# EasyEDA Pro project uven2-mk3-cc-driver-80x.eprj, board PCB1
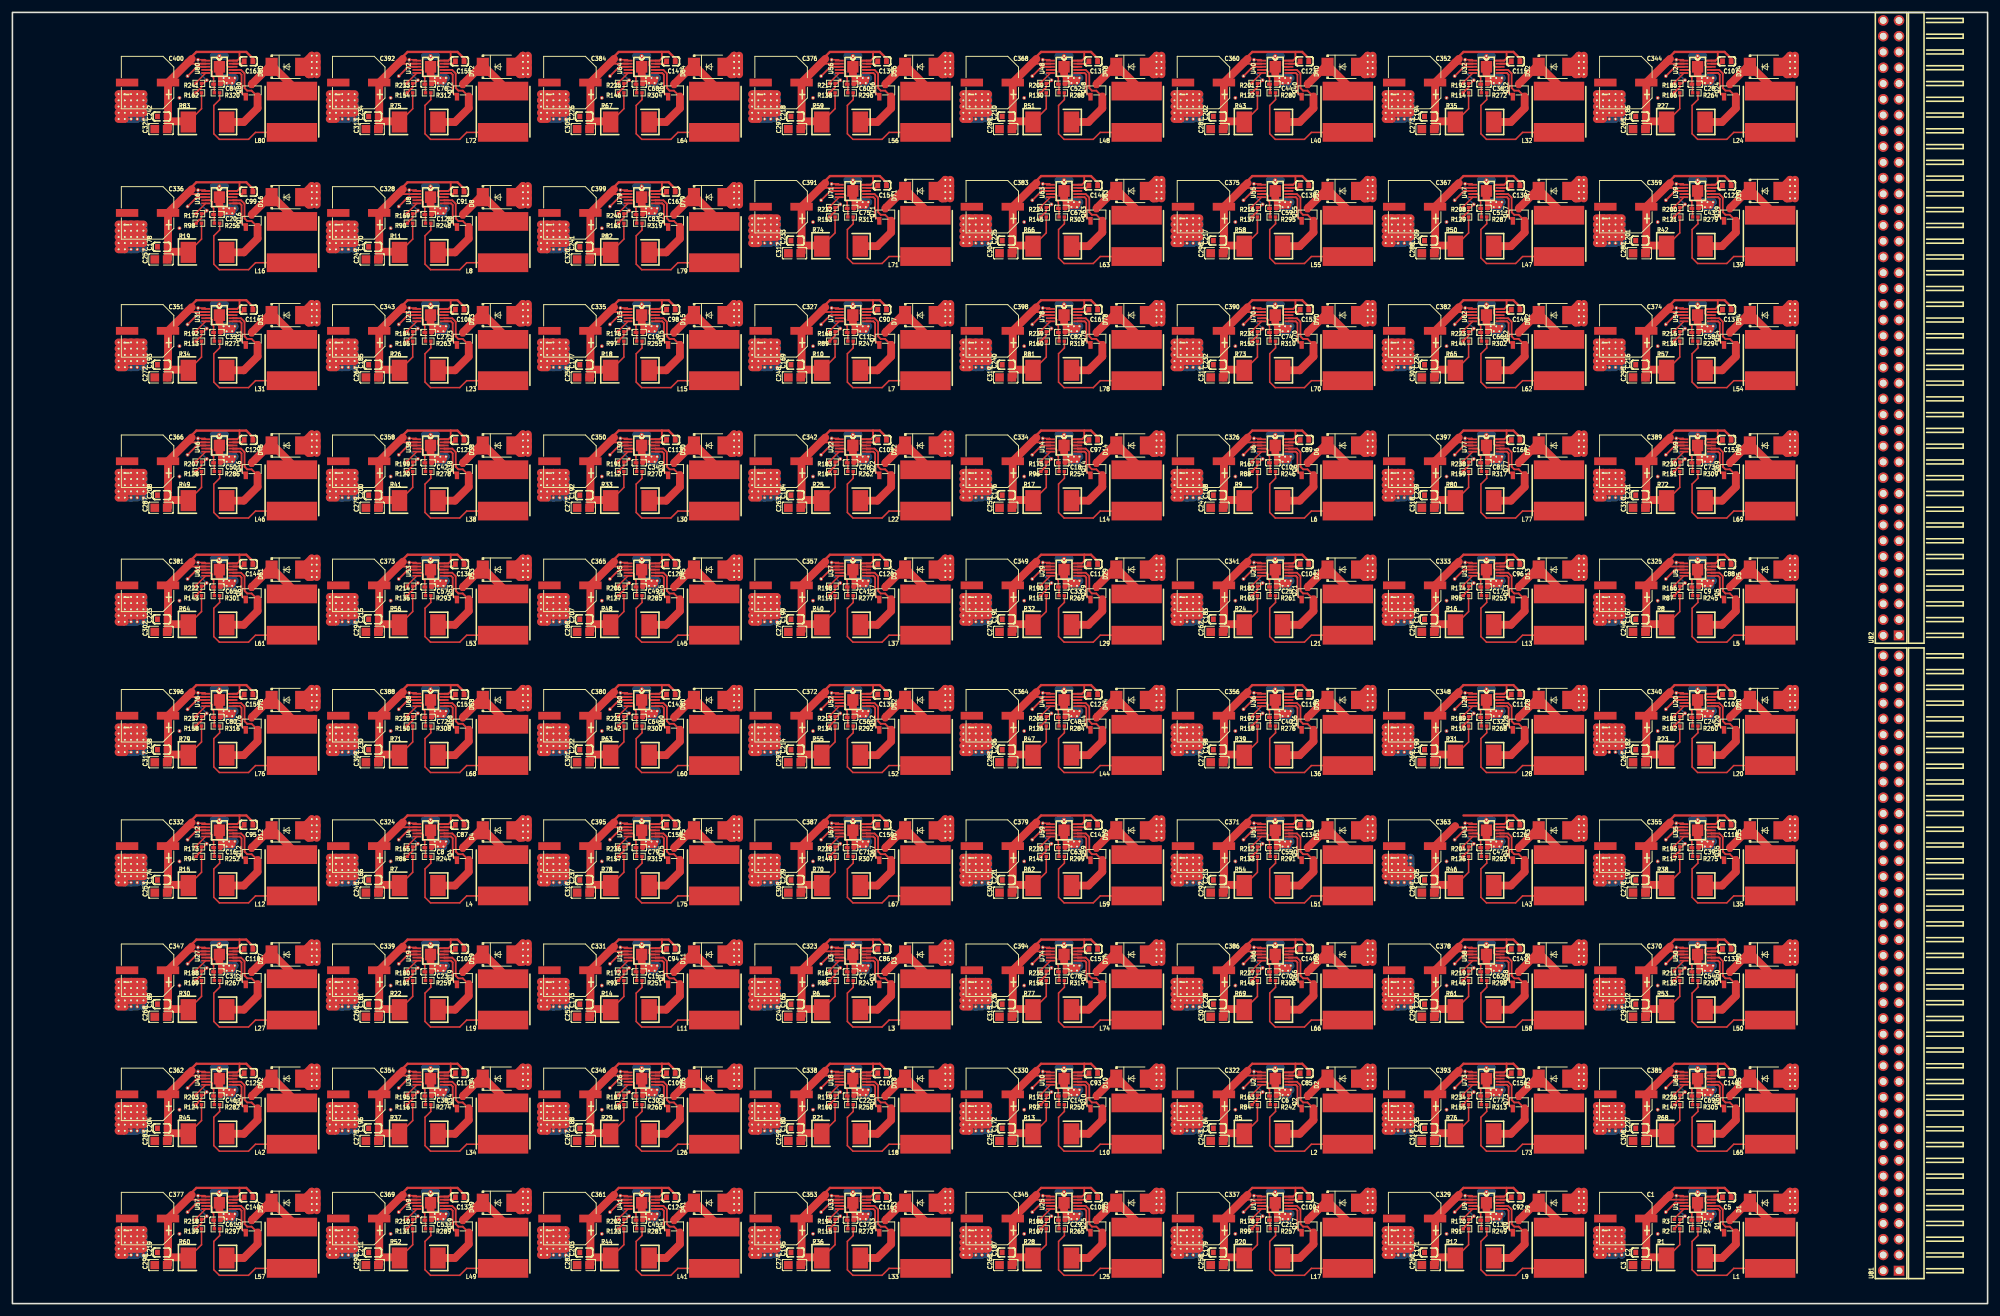
[diagram p2: board, top side]
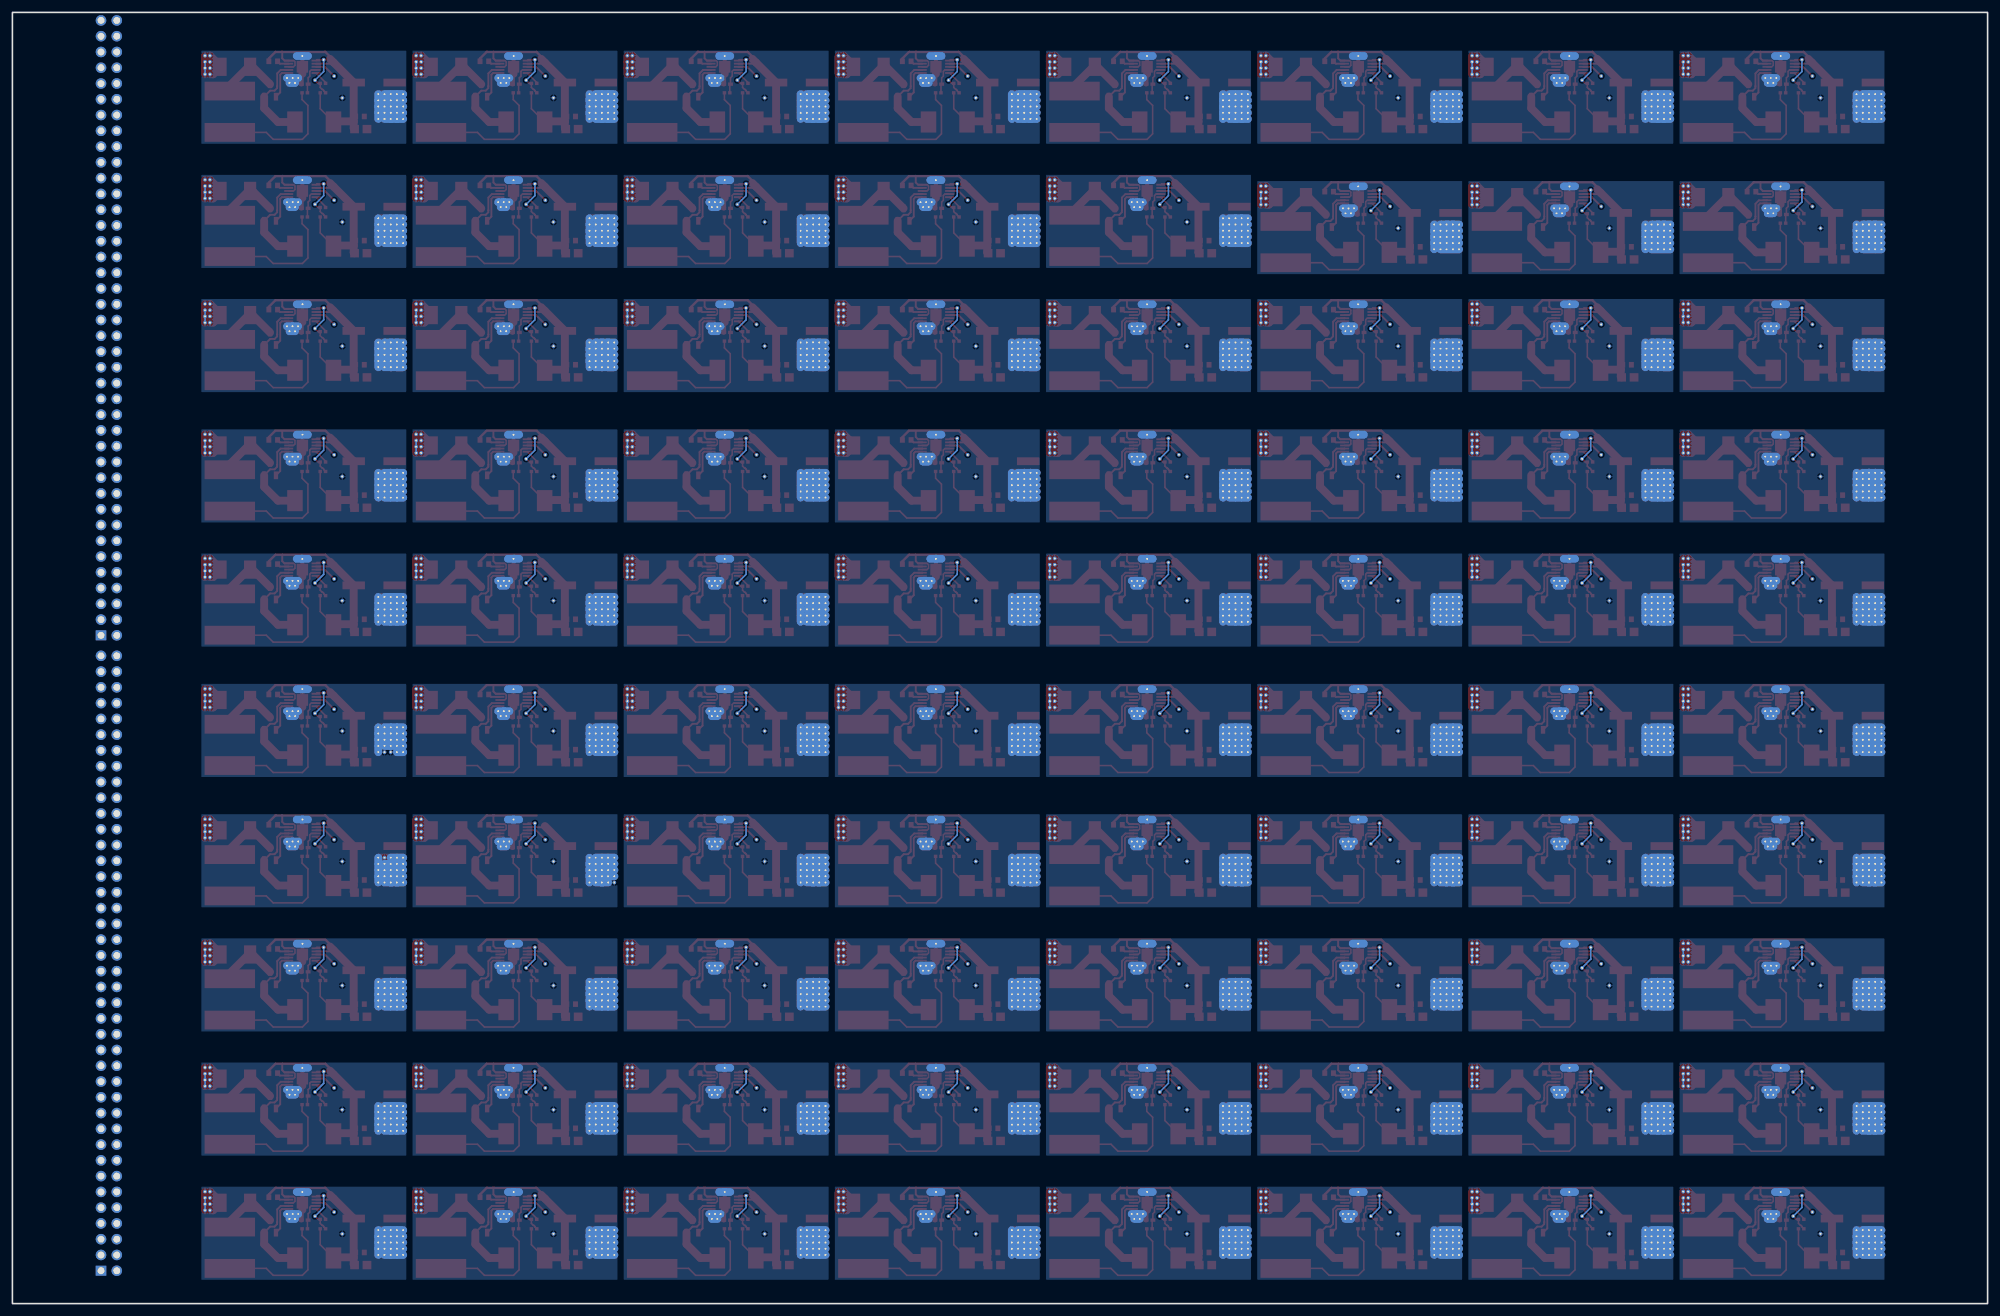
[diagram p3: board, bottom side, seen from below]

Outline 318 x 208 mm; copper layers: Top Layer, Inner1, Inner2, Bottom Layer. Coordinates in mm from the lower left corner of the outline.
Outline path: rectangle 0,208 318,0
Stack: Top Layer 0.035mm Outer layer thickness 1oz / Dielectric1 0.2104mm 7628 RC49% 8.6mil / Inner1 0.0152mm Inner layer thickness / Dielectric2 1.065mm 1.1mm H/HOZ Copper / Inner2 0.0152mm Inner layer thickness / Dielectric3 0.2104mm 7628 RC49% 8.6mil / Bottom Layer 0.035mm Outer layer thickness 1oz

## Design rules (mm)
template: JLCPCB Capability(Two Layers Board)
spacing copperThickness1oz (default): track to track 0.102, other pairs 0.152 to 0.3
spacing copperThickness2oz: track to track 0.203, other pairs 0.152 to 0.3
track width copperThickness1oz (default): min 0.127, default 0.254, max 2.54
track width copperThickness2oz: min 0.203, default 0.254, max 2.54
differential pair differentialPair (default): width min 0.127, default 0.254, max 2.54; gap min 0.152, default 0.152
via viaSize (default): diameter min 0.5, default 0.61, max 10; hole min 0.3, default 0.305, max 6.3

## Placement (name value [footprint] x y rotation side)
C1  470uF  [CAP-SMD_BD8.0-L8.3-W8.3-LS9.1-FD]  259.76 13.7 180 top
C2  1uF  [C0603]  262.04 8.24 0 top
C3  10uF  [C0805]  261.92 6.21 0 top
C4  1nF  [C0402]  270.94 13.44 180 top
C5  1uF  [C0603]  276.01 17.13 0 top
C6  1nF  [C0402]  202.94 33.44 180 top
C7  1nF  [C0402]  134.94 53.44 180 top
C8  1nF  [C0402]  66.94 73.44 180 top
C9  1nF  [C0402]  270.94 115.44 180 top
C10  1nF  [C0402]  202.94 135.44 180 top
C11  1nF  [C0402]  134.94 156.44 180 top
C12  1nF  [C0402]  66.94 175.44 180 top
C13  1nF  [C0402]  236.94 13.44 180 top
C14  1nF  [C0402]  168.94 33.44 180 top
C15  1nF  [C0402]  100.94 53.44 180 top
C16  1nF  [C0402]  32.94 73.44 180 top
C17  1nF  [C0402]  236.94 115.44 180 top
C18  1nF  [C0402]  168.94 135.44 180 top
C19  1nF  [C0402]  100.94 156.44 180 top
C20  1nF  [C0402]  32.94 175.44 180 top
C21  1nF  [C0402]  202.94 13.44 180 top
C22  1nF  [C0402]  134.94 33.44 180 top
C23  1nF  [C0402]  66.94 53.44 180 top
C24  1nF  [C0402]  270.94 94.44 180 top
C25  1nF  [C0402]  202.94 115.44 180 top
C26  1nF  [C0402]  134.94 135.44 180 top
C27  1nF  [C0402]  66.94 156.44 180 top
C28  1nF  [C0402]  270.94 196.44 180 top
C29  1nF  [C0402]  168.94 13.44 180 top
C30  1nF  [C0402]  100.94 33.44 180 top
C31  1nF  [C0402]  32.94 53.44 180 top
C32  1nF  [C0402]  236.94 94.44 180 top
C33  1nF  [C0402]  168.94 115.44 180 top
C34  1nF  [C0402]  100.94 135.44 180 top
C35  1nF  [C0402]  32.94 156.44 180 top
C36  1nF  [C0402]  236.94 196.44 180 top
C37  1nF  [C0402]  134.94 13.44 180 top
C38  1nF  [C0402]  66.94 33.44 180 top
C39  1nF  [C0402]  270.94 73.44 180 top
C40  1nF  [C0402]  202.94 94.44 180 top
C41  1nF  [C0402]  134.94 115.44 180 top
C42  1nF  [C0402]  66.94 135.44 180 top
C43  1nF  [C0402]  270.94 176.44 180 top
C44  1nF  [C0402]  202.94 196.44 180 top
C45  1nF  [C0402]  100.94 13.44 180 top
C46  1nF  [C0402]  32.94 33.44 180 top
C47  1nF  [C0402]  236.94 73.44 180 top
C48  1nF  [C0402]  168.94 94.44 180 top
C49  1nF  [C0402]  100.94 115.44 180 top
C50  1nF  [C0402]  32.94 135.44 180 top
C51  1nF  [C0402]  236.94 176.44 180 top
C52  1nF  [C0402]  168.94 196.44 180 top
C53  1nF  [C0402]  66.94 13.44 180 top
C54  1nF  [C0402]  270.94 53.44 180 top
C55  1nF  [C0402]  202.94 73.44 180 top
C56  1nF  [C0402]  134.94 94.44 180 top
C57  1nF  [C0402]  66.94 115.44 180 top
C58  1nF  [C0402]  270.94 156.44 180 top
C59  1nF  [C0402]  202.94 176.44 180 top
C60  1nF  [C0402]  134.94 196.44 180 top
C61  1nF  [C0402]  32.94 13.44 180 top
C62  1nF  [C0402]  236.94 53.44 180 top
C63  1nF  [C0402]  168.94 73.44 180 top
C64  1nF  [C0402]  100.94 94.44 180 top
C65  1nF  [C0402]  32.94 115.44 180 top
C66  1nF  [C0402]  236.94 156.44 180 top
C67  1nF  [C0402]  168.94 176.44 180 top
C68  1nF  [C0402]  100.94 196.44 180 top
C69  1nF  [C0402]  270.94 33.44 180 top
C70  1nF  [C0402]  202.94 53.44 180 top
C71  1nF  [C0402]  134.94 73.44 180 top
C72  1nF  [C0402]  66.94 94.44 180 top
C73  1nF  [C0402]  270.94 135.44 180 top
C74  1nF  [C0402]  202.94 156.44 180 top
C75  1nF  [C0402]  134.94 176.44 180 top
C76  1nF  [C0402]  66.94 196.44 180 top
C77  1nF  [C0402]  236.94 33.44 180 top
C78  1nF  [C0402]  168.94 53.44 180 top
C79  1nF  [C0402]  100.94 73.44 180 top
C80  1nF  [C0402]  32.94 94.44 180 top
C81  1nF  [C0402]  236.94 135.44 180 top
C82  1nF  [C0402]  168.94 156.44 180 top
C83  1nF  [C0402]  100.94 175.44 180 top
C84  1nF  [C0402]  32.94 196.44 180 top
C85  1uF  [C0603]  208.01 37.13 0 top
C86  1uF  [C0603]  140.01 57.13 0 top
C87  1uF  [C0603]  72.02 77.13 0 top
C88  1uF  [C0603]  276.01 119.13 0 top
C89  1uF  [C0603]  208.01 139.13 0 top
C90  1uF  [C0603]  140.01 160.13 0 top
C91  1uF  [C0603]  72.02 179.13 0 top
C92  1uF  [C0603]  242.01 17.13 0 top
C93  1uF  [C0603]  174.01 37.13 0 top
C94  1uF  [C0603]  106.02 57.13 0 top
C95  1uF  [C0603]  38.02 77.13 0 top
C96  1uF  [C0603]  242.01 119.13 0 top
C97  1uF  [C0603]  174.01 139.13 0 top
C98  1uF  [C0603]  106.02 160.13 0 top
C99  1uF  [C0603]  38.02 179.13 0 top
C100  1uF  [C0603]  208.01 17.13 0 top
C101  1uF  [C0603]  140.01 37.13 0 top
C102  1uF  [C0603]  72.02 57.13 0 top
C103  1uF  [C0603]  276.01 98.13 0 top
C104  1uF  [C0603]  208.01 119.13 0 top
C105  1uF  [C0603]  140.01 139.13 0 top
C106  1uF  [C0603]  72.02 160.13 0 top
C107  1uF  [C0603]  276.01 200.13 0 top
C108  1uF  [C0603]  174.01 17.13 0 top
C109  1uF  [C0603]  106.02 37.13 0 top
C110  1uF  [C0603]  38.02 57.13 0 top
C111  1uF  [C0603]  242.01 98.13 0 top
C112  1uF  [C0603]  174.01 119.13 0 top
C113  1uF  [C0603]  106.02 139.13 0 top
C114  1uF  [C0603]  38.02 160.13 0 top
C115  1uF  [C0603]  242.01 200.13 0 top
C116  1uF  [C0603]  140.01 17.13 0 top
C117  1uF  [C0603]  72.02 37.13 0 top
C118  1uF  [C0603]  276.01 77.13 0 top
C119  1uF  [C0603]  208.01 98.13 0 top
C120  1uF  [C0603]  140.01 119.13 0 top
C121  1uF  [C0603]  72.02 139.13 0 top
C122  1uF  [C0603]  276.01 180.13 0 top
C123  1uF  [C0603]  208.01 200.13 0 top
C124  1uF  [C0603]  106.02 17.13 0 top
C125  1uF  [C0603]  38.02 37.13 0 top
C126  1uF  [C0603]  242.01 77.13 0 top
C127  1uF  [C0603]  174.01 98.13 0 top
C128  1uF  [C0603]  106.02 119.13 0 top
C129  1uF  [C0603]  38.02 139.13 0 top
C130  1uF  [C0603]  242.01 180.13 0 top
C131  1uF  [C0603]  174.01 200.13 0 top
C132  1uF  [C0603]  72.02 17.13 0 top
C133  1uF  [C0603]  276.01 57.13 0 top
C134  1uF  [C0603]  208.01 77.13 0 top
C135  1uF  [C0603]  140.01 98.13 0 top
C136  1uF  [C0603]  72.02 119.13 0 top
C137  1uF  [C0603]  276.01 160.13 0 top
C138  1uF  [C0603]  208.01 180.13 0 top
C139  1uF  [C0603]  140.01 200.13 0 top
C140  1uF  [C0603]  38.02 17.13 0 top
C141  1uF  [C0603]  242.01 57.13 0 top
C142  1uF  [C0603]  174.01 77.13 0 top
C143  1uF  [C0603]  106.02 98.13 0 top
C144  1uF  [C0603]  38.02 119.13 0 top
C145  1uF  [C0603]  242.01 160.13 0 top
C146  1uF  [C0603]  174.01 180.13 0 top
C147  1uF  [C0603]  106.02 200.13 0 top
C148  1uF  [C0603]  276.01 37.13 0 top
C149  1uF  [C0603]  208.01 57.13 0 top
C150  1uF  [C0603]  140.01 77.13 0 top
C151  1uF  [C0603]  72.02 98.13 0 top
C152  1uF  [C0603]  276.01 139.13 0 top
C153  1uF  [C0603]  208.01 160.13 0 top
C154  1uF  [C0603]  140.01 180.13 0 top
C155  1uF  [C0603]  72.02 200.13 0 top
C156  1uF  [C0603]  242.01 37.13 0 top
C157  1uF  [C0603]  174.01 57.13 0 top
C158  1uF  [C0603]  106.02 77.13 0 top
C159  1uF  [C0603]  38.02 98.13 0 top
C160  1uF  [C0603]  242.01 139.13 0 top
C161  1uF  [C0603]  174.01 160.13 0 top
C162  1uF  [C0603]  106.02 179.13 0 top
C163  1uF  [C0603]  38.02 200.13 0 top
C164  1uF  [C0603]  194.04 28.24 0 top
C165  1uF  [C0603]  126.05 48.24 0 top
C166  1uF  [C0603]  58.05 68.24 0 top
C167  1uF  [C0603]  262.04 110.24 0 top
C168  1uF  [C0603]  194.04 130.24 0 top
C169  1uF  [C0603]  126.05 151.24 0 top
C170  1uF  [C0603]  58.05 170.24 0 top
C171  1uF  [C0603]  228.04 8.24 0 top
C172  1uF  [C0603]  160.04 28.24 0 top
C173  1uF  [C0603]  92.05 48.24 0 top
C174  1uF  [C0603]  24.05 68.24 0 top
C175  1uF  [C0603]  228.04 110.24 0 top
C176  1uF  [C0603]  160.04 130.24 0 top
C177  1uF  [C0603]  92.05 151.24 0 top
C178  1uF  [C0603]  24.05 170.24 0 top
C179  1uF  [C0603]  194.04 8.24 0 top
C180  1uF  [C0603]  126.05 28.24 0 top
C181  1uF  [C0603]  58.05 48.24 0 top
C182  1uF  [C0603]  262.04 89.24 0 top
C183  1uF  [C0603]  194.04 110.24 0 top
C184  1uF  [C0603]  126.05 130.24 0 top
C185  1uF  [C0603]  58.05 151.24 0 top
C186  1uF  [C0603]  262.04 191.24 0 top
C187  1uF  [C0603]  160.04 8.24 0 top
C188  1uF  [C0603]  92.05 28.24 0 top
C189  1uF  [C0603]  24.05 48.24 0 top
C190  1uF  [C0603]  228.04 89.24 0 top
C191  1uF  [C0603]  160.04 110.24 0 top
C192  1uF  [C0603]  92.05 130.24 0 top
C193  1uF  [C0603]  24.05 151.24 0 top
C194  1uF  [C0603]  228.04 191.24 0 top
C195  1uF  [C0603]  126.05 8.24 0 top
C196  1uF  [C0603]  58.05 28.24 0 top
C197  1uF  [C0603]  262.04 68.24 0 top
C198  1uF  [C0603]  194.04 89.24 0 top
C199  1uF  [C0603]  126.05 110.24 0 top
C200  1uF  [C0603]  58.05 130.24 0 top
C201  1uF  [C0603]  262.04 171.24 0 top
C202  1uF  [C0603]  194.04 191.24 0 top
C203  1uF  [C0603]  92.05 8.24 0 top
C204  1uF  [C0603]  24.05 28.24 0 top
C205  1uF  [C0603]  228.04 68.24 0 top
C206  1uF  [C0603]  160.04 89.24 0 top
C207  1uF  [C0603]  92.05 110.24 0 top
C208  1uF  [C0603]  24.05 130.24 0 top
C209  1uF  [C0603]  228.04 171.24 0 top
C210  1uF  [C0603]  160.04 191.24 0 top
C211  1uF  [C0603]  58.05 8.24 0 top
C212  1uF  [C0603]  262.04 48.24 0 top
C213  1uF  [C0603]  194.04 68.24 0 top
C214  1uF  [C0603]  126.05 89.24 0 top
C215  1uF  [C0603]  58.05 110.24 0 top
C216  1uF  [C0603]  262.04 151.24 0 top
C217  1uF  [C0603]  194.04 171.24 0 top
C218  1uF  [C0603]  126.05 191.24 0 top
C219  1uF  [C0603]  24.05 8.24 0 top
C220  1uF  [C0603]  228.04 48.24 0 top
C221  1uF  [C0603]  160.04 68.24 0 top
C222  1uF  [C0603]  92.05 89.24 0 top
C223  1uF  [C0603]  24.05 110.24 0 top
C224  1uF  [C0603]  228.04 151.24 0 top
C225  1uF  [C0603]  160.04 171.24 0 top
C226  1uF  [C0603]  92.05 191.24 0 top
C227  1uF  [C0603]  262.04 28.24 0 top
C228  1uF  [C0603]  194.04 48.24 0 top
C229  1uF  [C0603]  126.05 68.24 0 top
C230  1uF  [C0603]  58.05 89.24 0 top
C231  1uF  [C0603]  262.04 130.24 0 top
C232  1uF  [C0603]  194.04 151.24 0 top
C233  1uF  [C0603]  126.05 171.24 0 top
C234  1uF  [C0603]  58.05 191.24 0 top
C235  1uF  [C0603]  228.04 28.24 0 top
C236  1uF  [C0603]  160.04 48.24 0 top
C237  1uF  [C0603]  92.05 68.24 0 top
C238  1uF  [C0603]  24.05 89.24 0 top
C239  1uF  [C0603]  228.04 130.24 0 top
C240  1uF  [C0603]  160.04 151.24 0 top
C241  1uF  [C0603]  92.05 170.24 0 top
C242  1uF  [C0603]  24.05 191.24 0 top
C243  10uF  [C0805]  193.92 26.21 0 top
C244  10uF  [C0805]  125.92 46.21 0 top
C245  10uF  [C0805]  57.92 66.21 0 top
C246  10uF  [C0805]  261.92 108.21 0 top
C247  10uF  [C0805]  193.92 128.21 0 top
C248  10uF  [C0805]  125.92 149.21 0 top
C249  10uF  [C0805]  57.92 168.21 0 top
C250  10uF  [C0805]  227.92 6.21 0 top
C251  10uF  [C0805]  159.92 26.21 0 top
C252  10uF  [C0805]  91.92 46.21 0 top
C253  10uF  [C0805]  23.92 66.21 0 top
C254  10uF  [C0805]  227.92 108.21 0 top
C255  10uF  [C0805]  159.92 128.21 0 top
C256  10uF  [C0805]  91.92 149.21 0 top
C257  10uF  [C0805]  23.92 168.21 0 top
C258  10uF  [C0805]  193.92 6.21 0 top
C259  10uF  [C0805]  125.92 26.21 0 top
C260  10uF  [C0805]  57.92 46.21 0 top
C261  10uF  [C0805]  261.92 87.21 0 top
C262  10uF  [C0805]  193.92 108.21 0 top
C263  10uF  [C0805]  125.92 128.21 0 top
C264  10uF  [C0805]  57.92 149.21 0 top
C265  10uF  [C0805]  261.92 189.21 0 top
C266  10uF  [C0805]  159.92 6.21 0 top
C267  10uF  [C0805]  91.92 26.21 0 top
C268  10uF  [C0805]  23.92 46.21 0 top
C269  10uF  [C0805]  227.92 87.21 0 top
C270  10uF  [C0805]  159.92 108.21 0 top
C271  10uF  [C0805]  91.92 128.21 0 top
C272  10uF  [C0805]  23.92 149.21 0 top
C273  10uF  [C0805]  227.92 189.21 0 top
C274  10uF  [C0805]  125.92 6.21 0 top
C275  10uF  [C0805]  57.92 26.21 0 top
C276  10uF  [C0805]  261.92 66.21 0 top
C277  10uF  [C0805]  193.92 87.21 0 top
C278  10uF  [C0805]  125.92 108.21 0 top
C279  10uF  [C0805]  57.92 128.21 0 top
C280  10uF  [C0805]  261.92 169.21 0 top
C281  10uF  [C0805]  193.92 189.21 0 top
C282  10uF  [C0805]  91.92 6.21 0 top
C283  10uF  [C0805]  23.92 26.21 0 top
C284  10uF  [C0805]  227.92 66.21 0 top
C285  10uF  [C0805]  159.92 87.21 0 top
C286  10uF  [C0805]  91.92 108.21 0 top
C287  10uF  [C0805]  23.92 128.21 0 top
C288  10uF  [C0805]  227.92 169.21 0 top
C289  10uF  [C0805]  159.92 189.21 0 top
C290  10uF  [C0805]  57.92 6.21 0 top
C291  10uF  [C0805]  261.92 46.21 0 top
C292  10uF  [C0805]  193.92 66.21 0 top
C293  10uF  [C0805]  125.92 87.21 0 top
C294  10uF  [C0805]  57.92 108.21 0 top
C295  10uF  [C0805]  261.92 149.21 0 top
C296  10uF  [C0805]  193.92 169.21 0 top
C297  10uF  [C0805]  125.92 189.21 0 top
C298  10uF  [C0805]  23.92 6.21 0 top
C299  10uF  [C0805]  227.92 46.21 0 top
C300  10uF  [C0805]  159.92 66.21 0 top
C301  10uF  [C0805]  91.92 87.21 0 top
C302  10uF  [C0805]  23.92 108.21 0 top
C303  10uF  [C0805]  227.92 149.21 0 top
C304  10uF  [C0805]  159.92 169.21 0 top
C305  10uF  [C0805]  91.92 189.21 0 top
C306  10uF  [C0805]  261.92 26.21 0 top
C307  10uF  [C0805]  193.92 46.21 0 top
C308  10uF  [C0805]  125.92 66.21 0 top
C309  10uF  [C0805]  57.92 87.21 0 top
C310  10uF  [C0805]  261.92 128.21 0 top
C311  10uF  [C0805]  193.92 149.21 0 top
C312  10uF  [C0805]  125.92 169.21 0 top
C313  10uF  [C0805]  57.92 189.21 0 top
C314  10uF  [C0805]  227.92 26.21 0 top
C315  10uF  [C0805]  159.92 46.21 0 top
C316  10uF  [C0805]  91.92 66.21 0 top
C317  10uF  [C0805]  23.92 87.21 0 top
C318  10uF  [C0805]  227.92 128.21 0 top
C319  10uF  [C0805]  159.92 149.21 0 top
C320  10uF  [C0805]  91.92 168.21 0 top
C321  10uF  [C0805]  23.92 189.21 0 top
C322  470uF  [CAP-SMD_BD8.0-L8.3-W8.3-LS9.1-FD]  191.76 33.7 180 top
C323  470uF  [CAP-SMD_BD8.0-L8.3-W8.3-LS9.1-FD]  123.76 53.7 180 top
C324  470uF  [CAP-SMD_BD8.0-L8.3-W8.3-LS9.1-FD]  55.76 73.7 180 top
C325  470uF  [CAP-SMD_BD8.0-L8.3-W8.3-LS9.1-FD]  259.76 115.7 180 top
C326  470uF  [CAP-SMD_BD8.0-L8.3-W8.3-LS9.1-FD]  191.76 135.7 180 top
C327  470uF  [CAP-SMD_BD8.0-L8.3-W8.3-LS9.1-FD]  123.76 156.7 180 top
C328  470uF  [CAP-SMD_BD8.0-L8.3-W8.3-LS9.1-FD]  55.76 175.7 180 top
C329  470uF  [CAP-SMD_BD8.0-L8.3-W8.3-LS9.1-FD]  225.76 13.7 180 top
C330  470uF  [CAP-SMD_BD8.0-L8.3-W8.3-LS9.1-FD]  157.76 33.7 180 top
C331  470uF  [CAP-SMD_BD8.0-L8.3-W8.3-LS9.1-FD]  89.76 53.7 180 top
C332  470uF  [CAP-SMD_BD8.0-L8.3-W8.3-LS9.1-FD]  21.76 73.7 180 top
C333  470uF  [CAP-SMD_BD8.0-L8.3-W8.3-LS9.1-FD]  225.76 115.7 180 top
C334  470uF  [CAP-SMD_BD8.0-L8.3-W8.3-LS9.1-FD]  157.76 135.7 180 top
C335  470uF  [CAP-SMD_BD8.0-L8.3-W8.3-LS9.1-FD]  89.76 156.7 180 top
C336  470uF  [CAP-SMD_BD8.0-L8.3-W8.3-LS9.1-FD]  21.76 175.7 180 top
C337  470uF  [CAP-SMD_BD8.0-L8.3-W8.3-LS9.1-FD]  191.76 13.7 180 top
C338  470uF  [CAP-SMD_BD8.0-L8.3-W8.3-LS9.1-FD]  123.76 33.7 180 top
C339  470uF  [CAP-SMD_BD8.0-L8.3-W8.3-LS9.1-FD]  55.76 53.7 180 top
C340  470uF  [CAP-SMD_BD8.0-L8.3-W8.3-LS9.1-FD]  259.76 94.7 180 top
C341  470uF  [CAP-SMD_BD8.0-L8.3-W8.3-LS9.1-FD]  191.76 115.7 180 top
C342  470uF  [CAP-SMD_BD8.0-L8.3-W8.3-LS9.1-FD]  123.76 135.7 180 top
C343  470uF  [CAP-SMD_BD8.0-L8.3-W8.3-LS9.1-FD]  55.76 156.7 180 top
C344  470uF  [CAP-SMD_BD8.0-L8.3-W8.3-LS9.1-FD]  259.76 196.7 180 top
C345  470uF  [CAP-SMD_BD8.0-L8.3-W8.3-LS9.1-FD]  157.76 13.7 180 top
C346  470uF  [CAP-SMD_BD8.0-L8.3-W8.3-LS9.1-FD]  89.76 33.7 180 top
C347  470uF  [CAP-SMD_BD8.0-L8.3-W8.3-LS9.1-FD]  21.76 53.7 180 top
C348  470uF  [CAP-SMD_BD8.0-L8.3-W8.3-LS9.1-FD]  225.76 94.7 180 top
C349  470uF  [CAP-SMD_BD8.0-L8.3-W8.3-LS9.1-FD]  157.76 115.7 180 top
C350  470uF  [CAP-SMD_BD8.0-L8.3-W8.3-LS9.1-FD]  89.76 135.7 180 top
C351  470uF  [CAP-SMD_BD8.0-L8.3-W8.3-LS9.1-FD]  21.76 156.7 180 top
C352  470uF  [CAP-SMD_BD8.0-L8.3-W8.3-LS9.1-FD]  225.76 196.7 180 top
C353  470uF  [CAP-SMD_BD8.0-L8.3-W8.3-LS9.1-FD]  123.76 13.7 180 top
C354  470uF  [CAP-SMD_BD8.0-L8.3-W8.3-LS9.1-FD]  55.76 33.7 180 top
C355  470uF  [CAP-SMD_BD8.0-L8.3-W8.3-LS9.1-FD]  259.76 73.7 180 top
C356  470uF  [CAP-SMD_BD8.0-L8.3-W8.3-LS9.1-FD]  191.76 94.7 180 top
C357  470uF  [CAP-SMD_BD8.0-L8.3-W8.3-LS9.1-FD]  123.76 115.7 180 top
C358  470uF  [CAP-SMD_BD8.0-L8.3-W8.3-LS9.1-FD]  55.76 135.7 180 top
C359  470uF  [CAP-SMD_BD8.0-L8.3-W8.3-LS9.1-FD]  259.76 176.7 180 top
C360  470uF  [CAP-SMD_BD8.0-L8.3-W8.3-LS9.1-FD]  191.76 196.7 180 top
C361  470uF  [CAP-SMD_BD8.0-L8.3-W8.3-LS9.1-FD]  89.76 13.7 180 top
C362  470uF  [CAP-SMD_BD8.0-L8.3-W8.3-LS9.1-FD]  21.76 33.7 180 top
C363  470uF  [CAP-SMD_BD8.0-L8.3-W8.3-LS9.1-FD]  225.76 73.7 180 top
C364  470uF  [CAP-SMD_BD8.0-L8.3-W8.3-LS9.1-FD]  157.76 94.7 180 top
C365  470uF  [CAP-SMD_BD8.0-L8.3-W8.3-LS9.1-FD]  89.76 115.7 180 top
C366  470uF  [CAP-SMD_BD8.0-L8.3-W8.3-LS9.1-FD]  21.76 135.7 180 top
C367  470uF  [CAP-SMD_BD8.0-L8.3-W8.3-LS9.1-FD]  225.76 176.7 180 top
C368  470uF  [CAP-SMD_BD8.0-L8.3-W8.3-LS9.1-FD]  157.76 196.7 180 top
C369  470uF  [CAP-SMD_BD8.0-L8.3-W8.3-LS9.1-FD]  55.76 13.7 180 top
C370  470uF  [CAP-SMD_BD8.0-L8.3-W8.3-LS9.1-FD]  259.76 53.7 180 top
C371  470uF  [CAP-SMD_BD8.0-L8.3-W8.3-LS9.1-FD]  191.76 73.7 180 top
C372  470uF  [CAP-SMD_BD8.0-L8.3-W8.3-LS9.1-FD]  123.76 94.7 180 top
C373  470uF  [CAP-SMD_BD8.0-L8.3-W8.3-LS9.1-FD]  55.76 115.7 180 top
C374  470uF  [CAP-SMD_BD8.0-L8.3-W8.3-LS9.1-FD]  259.76 156.7 180 top
C375  470uF  [CAP-SMD_BD8.0-L8.3-W8.3-LS9.1-FD]  191.76 176.7 180 top
C376  470uF  [CAP-SMD_BD8.0-L8.3-W8.3-LS9.1-FD]  123.76 196.7 180 top
C377  470uF  [CAP-SMD_BD8.0-L8.3-W8.3-LS9.1-FD]  21.76 13.7 180 top
C378  470uF  [CAP-SMD_BD8.0-L8.3-W8.3-LS9.1-FD]  225.76 53.7 180 top
C379  470uF  [CAP-SMD_BD8.0-L8.3-W8.3-LS9.1-FD]  157.76 73.7 180 top
C380  470uF  [CAP-SMD_BD8.0-L8.3-W8.3-LS9.1-FD]  89.76 94.7 180 top
C381  470uF  [CAP-SMD_BD8.0-L8.3-W8.3-LS9.1-FD]  21.76 115.7 180 top
C382  470uF  [CAP-SMD_BD8.0-L8.3-W8.3-LS9.1-FD]  225.76 156.7 180 top
C383  470uF  [CAP-SMD_BD8.0-L8.3-W8.3-LS9.1-FD]  157.76 176.7 180 top
C384  470uF  [CAP-SMD_BD8.0-L8.3-W8.3-LS9.1-FD]  89.76 196.7 180 top
C385  470uF  [CAP-SMD_BD8.0-L8.3-W8.3-LS9.1-FD]  259.76 33.7 180 top
C386  470uF  [CAP-SMD_BD8.0-L8.3-W8.3-LS9.1-FD]  191.76 53.7 180 top
C387  470uF  [CAP-SMD_BD8.0-L8.3-W8.3-LS9.1-FD]  123.76 73.7 180 top
C388  470uF  [CAP-SMD_BD8.0-L8.3-W8.3-LS9.1-FD]  55.76 94.7 180 top
C389  470uF  [CAP-SMD_BD8.0-L8.3-W8.3-LS9.1-FD]  259.76 135.7 180 top
C390  470uF  [CAP-SMD_BD8.0-L8.3-W8.3-LS9.1-FD]  191.76 156.7 180 top
C391  470uF  [CAP-SMD_BD8.0-L8.3-W8.3-LS9.1-FD]  123.76 176.7 180 top
C392  470uF  [CAP-SMD_BD8.0-L8.3-W8.3-LS9.1-FD]  55.76 196.7 180 top
C393  470uF  [CAP-SMD_BD8.0-L8.3-W8.3-LS9.1-FD]  225.76 33.7 180 top
C394  470uF  [CAP-SMD_BD8.0-L8.3-W8.3-LS9.1-FD]  157.76 53.7 180 top
C395  470uF  [CAP-SMD_BD8.0-L8.3-W8.3-LS9.1-FD]  89.76 73.7 180 top
C396  470uF  [CAP-SMD_BD8.0-L8.3-W8.3-LS9.1-FD]  21.76 94.7 180 top
C397  470uF  [CAP-SMD_BD8.0-L8.3-W8.3-LS9.1-FD]  225.76 135.7 180 top
C398  470uF  [CAP-SMD_BD8.0-L8.3-W8.3-LS9.1-FD]  157.76 156.7 180 top
C399  470uF  [CAP-SMD_BD8.0-L8.3-W8.3-LS9.1-FD]  89.76 175.7 180 top
C400  470uF  [CAP-SMD_BD8.0-L8.3-W8.3-LS9.1-FD]  21.76 196.7 180 top
D1  SR34_R2_00001  [SMB_L4.3-W3.6-LS5.4-R-RD]  282.11 16.24 0 top
D2  SR34_R2_00001  [SMB_L4.3-W3.6-LS5.4-R-RD]  214.11 36.24 0 top
D3  SR34_R2_00001  [SMB_L4.3-W3.6-LS5.4-R-RD]  146.11 56.24 0 top
D4  SR34_R2_00001  [SMB_L4.3-W3.6-LS5.4-R-RD]  78.11 76.24 0 top
D5  SR34_R2_00001  [SMB_L4.3-W3.6-LS5.4-R-RD]  282.11 118.24 0 top
D6  SR34_R2_00001  [SMB_L4.3-W3.6-LS5.4-R-RD]  214.11 138.24 0 top
D7  SR34_R2_00001  [SMB_L4.3-W3.6-LS5.4-R-RD]  146.11 159.24 0 top
D8  SR34_R2_00001  [SMB_L4.3-W3.6-LS5.4-R-RD]  78.11 178.24 0 top
D9  SR34_R2_00001  [SMB_L4.3-W3.6-LS5.4-R-RD]  248.11 16.24 0 top
D10  SR34_R2_00001  [SMB_L4.3-W3.6-LS5.4-R-RD]  180.11 36.24 0 top
D11  SR34_R2_00001  [SMB_L4.3-W3.6-LS5.4-R-RD]  112.11 56.24 0 top
D12  SR34_R2_00001  [SMB_L4.3-W3.6-LS5.4-R-RD]  44.11 76.24 0 top
D13  SR34_R2_00001  [SMB_L4.3-W3.6-LS5.4-R-RD]  248.11 118.24 0 top
D14  SR34_R2_00001  [SMB_L4.3-W3.6-LS5.4-R-RD]  180.11 138.24 0 top
D15  SR34_R2_00001  [SMB_L4.3-W3.6-LS5.4-R-RD]  112.11 159.24 0 top
D16  SR34_R2_00001  [SMB_L4.3-W3.6-LS5.4-R-RD]  44.11 178.24 0 top
D17  SR34_R2_00001  [SMB_L4.3-W3.6-LS5.4-R-RD]  214.11 16.24 0 top
D18  SR34_R2_00001  [SMB_L4.3-W3.6-LS5.4-R-RD]  146.11 36.24 0 top
D19  SR34_R2_00001  [SMB_L4.3-W3.6-LS5.4-R-RD]  78.11 56.24 0 top
D20  SR34_R2_00001  [SMB_L4.3-W3.6-LS5.4-R-RD]  282.11 97.24 0 top
D21  SR34_R2_00001  [SMB_L4.3-W3.6-LS5.4-R-RD]  214.11 118.24 0 top
D22  SR34_R2_00001  [SMB_L4.3-W3.6-LS5.4-R-RD]  146.11 138.24 0 top
D23  SR34_R2_00001  [SMB_L4.3-W3.6-LS5.4-R-RD]  78.11 159.24 0 top
D24  SR34_R2_00001  [SMB_L4.3-W3.6-LS5.4-R-RD]  282.11 199.24 0 top
D25  SR34_R2_00001  [SMB_L4.3-W3.6-LS5.4-R-RD]  180.11 16.24 0 top
D26  SR34_R2_00001  [SMB_L4.3-W3.6-LS5.4-R-RD]  112.11 36.24 0 top
D27  SR34_R2_00001  [SMB_L4.3-W3.6-LS5.4-R-RD]  44.11 56.24 0 top
D28  SR34_R2_00001  [SMB_L4.3-W3.6-LS5.4-R-RD]  248.11 97.24 0 top
D29  SR34_R2_00001  [SMB_L4.3-W3.6-LS5.4-R-RD]  180.11 118.24 0 top
D30  SR34_R2_00001  [SMB_L4.3-W3.6-LS5.4-R-RD]  112.11 138.24 0 top
D31  SR34_R2_00001  [SMB_L4.3-W3.6-LS5.4-R-RD]  44.11 159.24 0 top
D32  SR34_R2_00001  [SMB_L4.3-W3.6-LS5.4-R-RD]  248.11 199.24 0 top
D33  SR34_R2_00001  [SMB_L4.3-W3.6-LS5.4-R-RD]  146.11 16.24 0 top
D34  SR34_R2_00001  [SMB_L4.3-W3.6-LS5.4-R-RD]  78.11 36.24 0 top
D35  SR34_R2_00001  [SMB_L4.3-W3.6-LS5.4-R-RD]  282.11 76.24 0 top
D36  SR34_R2_00001  [SMB_L4.3-W3.6-LS5.4-R-RD]  214.11 97.24 0 top
D37  SR34_R2_00001  [SMB_L4.3-W3.6-LS5.4-R-RD]  146.11 118.24 0 top
D38  SR34_R2_00001  [SMB_L4.3-W3.6-LS5.4-R-RD]  78.11 138.24 0 top
D39  SR34_R2_00001  [SMB_L4.3-W3.6-LS5.4-R-RD]  282.11 179.24 0 top
D40  SR34_R2_00001  [SMB_L4.3-W3.6-LS5.4-R-RD]  214.11 199.24 0 top
D41  SR34_R2_00001  [SMB_L4.3-W3.6-LS5.4-R-RD]  112.11 16.24 0 top
D42  SR34_R2_00001  [SMB_L4.3-W3.6-LS5.4-R-RD]  44.11 36.24 0 top
D43  SR34_R2_00001  [SMB_L4.3-W3.6-LS5.4-R-RD]  248.11 76.24 0 top
D44  SR34_R2_00001  [SMB_L4.3-W3.6-LS5.4-R-RD]  180.11 97.24 0 top
D45  SR34_R2_00001  [SMB_L4.3-W3.6-LS5.4-R-RD]  112.11 118.24 0 top
D46  SR34_R2_00001  [SMB_L4.3-W3.6-LS5.4-R-RD]  44.11 138.24 0 top
D47  SR34_R2_00001  [SMB_L4.3-W3.6-LS5.4-R-RD]  248.11 179.24 0 top
D48  SR34_R2_00001  [SMB_L4.3-W3.6-LS5.4-R-RD]  180.11 199.24 0 top
D49  SR34_R2_00001  [SMB_L4.3-W3.6-LS5.4-R-RD]  78.11 16.24 0 top
D50  SR34_R2_00001  [SMB_L4.3-W3.6-LS5.4-R-RD]  282.11 56.24 0 top
D51  SR34_R2_00001  [SMB_L4.3-W3.6-LS5.4-R-RD]  214.11 76.24 0 top
D52  SR34_R2_00001  [SMB_L4.3-W3.6-LS5.4-R-RD]  146.11 97.24 0 top
D53  SR34_R2_00001  [SMB_L4.3-W3.6-LS5.4-R-RD]  78.11 118.24 0 top
D54  SR34_R2_00001  [SMB_L4.3-W3.6-LS5.4-R-RD]  282.11 159.24 0 top
D55  SR34_R2_00001  [SMB_L4.3-W3.6-LS5.4-R-RD]  214.11 179.24 0 top
D56  SR34_R2_00001  [SMB_L4.3-W3.6-LS5.4-R-RD]  146.11 199.24 0 top
D57  SR34_R2_00001  [SMB_L4.3-W3.6-LS5.4-R-RD]  44.11 16.24 0 top
D58  SR34_R2_00001  [SMB_L4.3-W3.6-LS5.4-R-RD]  248.11 56.24 0 top
D59  SR34_R2_00001  [SMB_L4.3-W3.6-LS5.4-R-RD]  180.11 76.24 0 top
D60  SR34_R2_00001  [SMB_L4.3-W3.6-LS5.4-R-RD]  112.11 97.24 0 top
D61  SR34_R2_00001  [SMB_L4.3-W3.6-LS5.4-R-RD]  44.11 118.24 0 top
D62  SR34_R2_00001  [SMB_L4.3-W3.6-LS5.4-R-RD]  248.11 159.24 0 top
D63  SR34_R2_00001  [SMB_L4.3-W3.6-LS5.4-R-RD]  180.11 179.24 0 top
D64  SR34_R2_00001  [SMB_L4.3-W3.6-LS5.4-R-RD]  112.11 199.24 0 top
D65  SR34_R2_00001  [SMB_L4.3-W3.6-LS5.4-R-RD]  282.11 36.24 0 top
D66  SR34_R2_00001  [SMB_L4.3-W3.6-LS5.4-R-RD]  214.11 56.24 0 top
D67  SR34_R2_00001  [SMB_L4.3-W3.6-LS5.4-R-RD]  146.11 76.24 0 top
D68  SR34_R2_00001  [SMB_L4.3-W3.6-LS5.4-R-RD]  78.11 97.24 0 top
D69  SR34_R2_00001  [SMB_L4.3-W3.6-LS5.4-R-RD]  282.11 138.24 0 top
D70  SR34_R2_00001  [SMB_L4.3-W3.6-LS5.4-R-RD]  214.11 159.24 0 top
D71  SR34_R2_00001  [SMB_L4.3-W3.6-LS5.4-R-RD]  146.11 179.24 0 top
D72  SR34_R2_00001  [SMB_L4.3-W3.6-LS5.4-R-RD]  78.11 199.24 0 top
D73  SR34_R2_00001  [SMB_L4.3-W3.6-LS5.4-R-RD]  248.11 36.24 0 top
D74  SR34_R2_00001  [SMB_L4.3-W3.6-LS5.4-R-RD]  180.11 56.24 0 top
D75  SR34_R2_00001  [SMB_L4.3-W3.6-LS5.4-R-RD]  112.11 76.24 0 top
D76  SR34_R2_00001  [SMB_L4.3-W3.6-LS5.4-R-RD]  44.11 97.24 0 top
D77  SR34_R2_00001  [SMB_L4.3-W3.6-LS5.4-R-RD]  248.11 138.24 0 top
D78  SR34_R2_00001  [SMB_L4.3-W3.6-LS5.4-R-RD]  180.11 159.24 0 top
D79  SR34_R2_00001  [SMB_L4.3-W3.6-LS5.4-R-RD]  112.11 178.24 0 top
D80  SR34_R2_00001  [SMB_L4.3-W3.6-LS5.4-R-RD]  44.11 199.24 0 top
L1  15uH  [IND-SMD_L8.0-W8.0-HPC8040NF-150M]  283 9 90 top
L2  15uH  [IND-SMD_L8.0-W8.0-HPC8040NF-150M]  215 29 90 top
L3  15uH  [IND-SMD_L8.0-W8.0-HPC8040NF-150M]  147 49 90 top
L4  15uH  [IND-SMD_L8.0-W8.0-HPC8040NF-150M]  79 69 90 top
L5  15uH  [IND-SMD_L8.0-W8.0-HPC8040NF-150M]  283 111 90 top
L6  15uH  [IND-SMD_L8.0-W8.0-HPC8040NF-150M]  215 131 90 top
L7  15uH  [IND-SMD_L8.0-W8.0-HPC8040NF-150M]  147 152 90 top
L8  15uH  [IND-SMD_L8.0-W8.0-HPC8040NF-150M]  79 171 90 top
L9  15uH  [IND-SMD_L8.0-W8.0-HPC8040NF-150M]  249 9 90 top
L10  15uH  [IND-SMD_L8.0-W8.0-HPC8040NF-150M]  181 29 90 top
L11  15uH  [IND-SMD_L8.0-W8.0-HPC8040NF-150M]  113 49 90 top
L12  15uH  [IND-SMD_L8.0-W8.0-HPC8040NF-150M]  45 69 90 top
L13  15uH  [IND-SMD_L8.0-W8.0-HPC8040NF-150M]  249 111 90 top
L14  15uH  [IND-SMD_L8.0-W8.0-HPC8040NF-150M]  181 131 90 top
L15  15uH  [IND-SMD_L8.0-W8.0-HPC8040NF-150M]  113 152 90 top
L16  15uH  [IND-SMD_L8.0-W8.0-HPC8040NF-150M]  45 171 90 top
L17  15uH  [IND-SMD_L8.0-W8.0-HPC8040NF-150M]  215 9 90 top
L18  15uH  [IND-SMD_L8.0-W8.0-HPC8040NF-150M]  147 29 90 top
L19  15uH  [IND-SMD_L8.0-W8.0-HPC8040NF-150M]  79 49 90 top
L20  15uH  [IND-SMD_L8.0-W8.0-HPC8040NF-150M]  283 90 90 top
L21  15uH  [IND-SMD_L8.0-W8.0-HPC8040NF-150M]  215 111 90 top
L22  15uH  [IND-SMD_L8.0-W8.0-HPC8040NF-150M]  147 131 90 top
L23  15uH  [IND-SMD_L8.0-W8.0-HPC8040NF-150M]  79 152 90 top
L24  15uH  [IND-SMD_L8.0-W8.0-HPC8040NF-150M]  283 192 90 top
L25  15uH  [IND-SMD_L8.0-W8.0-HPC8040NF-150M]  181 9 90 top
L26  15uH  [IND-SMD_L8.0-W8.0-HPC8040NF-150M]  113 29 90 top
L27  15uH  [IND-SMD_L8.0-W8.0-HPC8040NF-150M]  45 49 90 top
L28  15uH  [IND-SMD_L8.0-W8.0-HPC8040NF-150M]  249 90 90 top
L29  15uH  [IND-SMD_L8.0-W8.0-HPC8040NF-150M]  181 111 90 top
L30  15uH  [IND-SMD_L8.0-W8.0-HPC8040NF-150M]  113 131 90 top
L31  15uH  [IND-SMD_L8.0-W8.0-HPC8040NF-150M]  45 152 90 top
L32  15uH  [IND-SMD_L8.0-W8.0-HPC8040NF-150M]  249 192 90 top
L33  15uH  [IND-SMD_L8.0-W8.0-HPC8040NF-150M]  147 9 90 top
L34  15uH  [IND-SMD_L8.0-W8.0-HPC8040NF-150M]  79 29 90 top
L35  15uH  [IND-SMD_L8.0-W8.0-HPC8040NF-150M]  283 69 90 top
L36  15uH  [IND-SMD_L8.0-W8.0-HPC8040NF-150M]  215 90 90 top
L37  15uH  [IND-SMD_L8.0-W8.0-HPC8040NF-150M]  147 111 90 top
L38  15uH  [IND-SMD_L8.0-W8.0-HPC8040NF-150M]  79 131 90 top
L39  15uH  [IND-SMD_L8.0-W8.0-HPC8040NF-150M]  283 172 90 top
L40  15uH  [IND-SMD_L8.0-W8.0-HPC8040NF-150M]  215 192 90 top
L41  15uH  [IND-SMD_L8.0-W8.0-HPC8040NF-150M]  113 9 90 top
L42  15uH  [IND-SMD_L8.0-W8.0-HPC8040NF-150M]  45 29 90 top
L43  15uH  [IND-SMD_L8.0-W8.0-HPC8040NF-150M]  249 69 90 top
L44  15uH  [IND-SMD_L8.0-W8.0-HPC8040NF-150M]  181 90 90 top
L45  15uH  [IND-SMD_L8.0-W8.0-HPC8040NF-150M]  113 111 90 top
L46  15uH  [IND-SMD_L8.0-W8.0-HPC8040NF-150M]  45 131 90 top
L47  15uH  [IND-SMD_L8.0-W8.0-HPC8040NF-150M]  249 172 90 top
L48  15uH  [IND-SMD_L8.0-W8.0-HPC8040NF-150M]  181 192 90 top
L49  15uH  [IND-SMD_L8.0-W8.0-HPC8040NF-150M]  79 9 90 top
L50  15uH  [IND-SMD_L8.0-W8.0-HPC8040NF-150M]  283 49 90 top
L51  15uH  [IND-SMD_L8.0-W8.0-HPC8040NF-150M]  215 69 90 top
L52  15uH  [IND-SMD_L8.0-W8.0-HPC8040NF-150M]  147 90 90 top
L53  15uH  [IND-SMD_L8.0-W8.0-HPC8040NF-150M]  79 111 90 top
L54  15uH  [IND-SMD_L8.0-W8.0-HPC8040NF-150M]  283 152 90 top
L55  15uH  [IND-SMD_L8.0-W8.0-HPC8040NF-150M]  215 172 90 top
L56  15uH  [IND-SMD_L8.0-W8.0-HPC8040NF-150M]  147 192 90 top
L57  15uH  [IND-SMD_L8.0-W8.0-HPC8040NF-150M]  45 9 90 top
L58  15uH  [IND-SMD_L8.0-W8.0-HPC8040NF-150M]  249 49 90 top
L59  15uH  [IND-SMD_L8.0-W8.0-HPC8040NF-150M]  181 69 90 top
L60  15uH  [IND-SMD_L8.0-W8.0-HPC8040NF-150M]  113 90 90 top
L61  15uH  [IND-SMD_L8.0-W8.0-HPC8040NF-150M]  45 111 90 top
L62  15uH  [IND-SMD_L8.0-W8.0-HPC8040NF-150M]  249 152 90 top
L63  15uH  [IND-SMD_L8.0-W8.0-HPC8040NF-150M]  181 172 90 top
L64  15uH  [IND-SMD_L8.0-W8.0-HPC8040NF-150M]  113 192 90 top
L65  15uH  [IND-SMD_L8.0-W8.0-HPC8040NF-150M]  283 29 90 top
L66  15uH  [IND-SMD_L8.0-W8.0-HPC8040NF-150M]  215 49 90 top
L67  15uH  [IND-SMD_L8.0-W8.0-HPC8040NF-150M]  147 69 90 top
L68  15uH  [IND-SMD_L8.0-W8.0-HPC8040NF-150M]  79 90 90 top
L69  15uH  [IND-SMD_L8.0-W8.0-HPC8040NF-150M]  283 131 90 top
L70  15uH  [IND-SMD_L8.0-W8.0-HPC8040NF-150M]  215 152 90 top
L71  15uH  [IND-SMD_L8.0-W8.0-HPC8040NF-150M]  147 172 90 top
L72  15uH  [IND-SMD_L8.0-W8.0-HPC8040NF-150M]  79 192 90 top
L73  15uH  [IND-SMD_L8.0-W8.0-HPC8040NF-150M]  249 29 90 top
L74  15uH  [IND-SMD_L8.0-W8.0-HPC8040NF-150M]  181 49 90 top
L75  15uH  [IND-SMD_L8.0-W8.0-HPC8040NF-150M]  113 69 90 top
L76  15uH  [IND-SMD_L8.0-W8.0-HPC8040NF-150M]  45 90 90 top
L77  15uH  [IND-SMD_L8.0-W8.0-HPC8040NF-150M]  249 131 90 top
L78  15uH  [IND-SMD_L8.0-W8.0-HPC8040NF-150M]  181 152 90 top
L79  15uH  [IND-SMD_L8.0-W8.0-HPC8040NF-150M]  113 171 90 top
L80  15uH  [IND-SMD_L8.0-W8.0-HPC8040NF-150M]  45 192 90 top
NOREF  -  [Pad_e74173]  116.99 177.03 0 top
NOREF#2  -  [Pad_e65865]  255.09 71.83 0 top
NOREF#3  -  [Pad_e63436]  119.09 130.83 0 top
NOREF#4  -  [Pad_e60828]  60.89 173.23 0 top
NOREF#5  -  [Pad_e64573]  225.09 88.83 0 top
NOREF#6  -  [Pad_e72445]  187.09 154.83 0 top
NOREF#7  -  [Pad_e64755]  156.09 110.83 0 top
NOREF#8  -  [Pad_e60805]  52.09 170.83 0 top
NOREF#9  -  [Pad_e59678]  189.09 28.83 0 top
NOREF#10  -  [Pad_e70563]  97.89 98.38 0 top
NOREF#11  -  [Pad_e69072]  120.09 90.83 0 top
NOREF#12  -  [Pad_e65142]  34.49 156.63 0 top
NOREF#13  -  [Pad_e65900]  286.99 78.03 0 top
NOREF#14  -  [Pad_e71893]  121.09 69.83 0 top
NOREF#15  -  [Pad_e67023]  116.19 16.03 0 top
NOREF#16  -  [Pad_e63236]  190.09 113.83 0 top
NOREF#17  -  [Pad_e69252]  54.09 113.83 0 top
NOREF#18  -  [Pad_e62675]  120.09 30.83 0 top
NOREF#19  -  [Pad_e61552]  18.09 69.83 0 top
NOREF#20  -  [Pad_e72099]  82.19 97.03 0 top
NOREF#21  -  [Pad_e70400]  156.09 67.83 0 top
NOREF#22  -  [Pad_e69812]  133.28 197.08 0 top
NOREF#23  -  [Pad_e65521]  150.19 15.03 0 top
NOREF#24  -  [Pad_e67755]  85.09 111.83 0 top
NOREF#25  -  [Pad_e59692]  218.19 38.03 0 top
NOREF#26  -  [Pad_e61539]  29.89 77.38 0 top
NOREF#27  -  [Pad_e71511]  256.09 30.83 0 top
NOREF#28  -  [Pad_e66461]  82.19 137.03 0 top
NOREF#29  -  [Pad_e70381]  157.09 71.83 0 top
NOREF#30  -  [Pad_e68151]  252.19 179.03 0 top
NOREF#31  -  [Pad_e60237]  257.09 111.83 0 top
NOREF#32  -  [Pad_e72452]  189.09 153.83 0 top
NOREF#33  -  [Pad_e73021]  223.09 29.83 0 top
NOREF#34  -  [Pad_e72656]  122.09 170.83 0 top
NOREF#35  -  [Pad_e64368]  19.09 50.83 0 top
NOREF#36  -  [Pad_e63817]  255.09 190.83 0 top
NOREF#37  -  [Pad_e69832]  123.09 191.83 0 top
NOREF#38  -  [Pad_e69070]  123.09 91.83 0 top
NOREF#39  -  [Pad_e63242]  191.09 112.83 0 top
NOREF#40  -  [Pad_e71322]  85.09 193.83 0 top
NOREF#41  -  [Pad_e69849]  150.99 198.03 0 top
NOREF#42  -  [Pad_e73784]  224.09 129.83 0 top
NOREF#43  -  [Pad_e71914]  150.19 77.03 0 top
NOREF#44  -  [Pad_e69091]  150.19 97.03 0 top
NOREF#45  -  [Pad_e70016]  17.09 8.83 0 top
NOREF#46  -  [Pad_e70601]  116.99 96.03 0 top
NOREF#47  -  [Pad_e62294]  18.09 173.83 0 top
NOREF#48  -  [Pad_e70973]  252.19 158.03 0 top
NOREF#49  -  [Pad_e72645]  121.09 172.83 0 top
NOREF#50  -  [Pad_e72856]  82.99 201.03 0 top
NOREF#51  -  [Pad_e71519]  259.09 29.83 0 top
NOREF#52  -  [Pad_e60074]  82.99 77.03 0 top
NOREF#53  -  [Pad_e61565]  21.09 67.83 0 top
NOREF#54  -  [Pad_e65695]  54.09 28.83 0 top
NOREF#55  -  [Pad_e73772]  222.09 131.83 0 top
NOREF#56  -  [Pad_e73022]  224.09 29.83 0 top
NOREF#57  -  [Pad_e67218]  48.99 37.03 0 top
NOREF#58  -  [Pad_e64563]  225.09 90.83 0 top
NOREF#59  -  [Pad_e63649]  62.2 157.74 0 top
NOREF#60  -  [Pad_e71879]  131.89 77.38 0 top
NOREF#61  -  [Pad_e60637]  150.99 158.03 0 top
NOREF#62  -  [Pad_e63266]  218.19 119.03 0 top
NOREF#63  -  [Pad_e71528]  258.09 27.83 0 top
NOREF#64  -  [Pad_e64185]  87.09 29.83 0 top
NOREF#65  -  [Pad_e63811]  259.09 192.83 0 top
NOREF#66  -  [Pad_e59872]  122.09 47.83 0 top
NOREF#67  -  [Pad_e70604]  94.89 92.23 0 top
NOREF#68  -  [Pad_e71319]  87.09 194.83 0 top
NOREF#69  -  [Pad_e65683]  52.09 30.83 0 top
NOREF#70  -  [Pad_e71731]  203.32 57.98 0 top
NOREF#71  -  [Pad_e63438]  121.09 130.83 0 top
NOREF#72  -  [Pad_e73198]  154.09 51.83 0 top
NOREF#73  -  [Pad_e67591]  184.99 97.03 0 top
NOREF#74  -  [Pad_e60050]  54.09 69.83 0 top
NOREF#75  -  [Pad_e72640]  121.09 173.83 0 top
NOREF#76  -  [Pad_e60429]  188.09 130.83 0 top
NOREF#77  -  [Pad_e65680]  54.09 31.83 0 top
NOREF#78  -  [Pad_e67942]  21.09 132.83 0 top
NOREF#79  -  [Pad_e70037]  48.99 15.03 0 top
NOREF#80  -  [Pad_e70225]  252.99 55.03 0 top
NOREF#81  -  [Pad_e63616]  53.09 153.83 0 top
NOREF#82  -  [Pad_e64928]  88.09 133.83 0 top
NOREF#83  -  [Pad_e72259]  257.09 133.83 0 top
NOREF#84  -  [Pad_e61734]  221.09 112.83 0 top
NOREF#85  -  [Pad_e70587]  87.09 88.83 0 top
NOREF#86  -  [Pad_e60788]  65.28 176.08 0 top
NOREF#87  -  [Pad_e70590]  101.99 95.43 0 top
NOREF#88  -  [Pad_e73764]  224.09 133.83 0 top
NOREF#89  -  [Pad_e60630]  136.49 156.63 0 top
NOREF#90  -  [Pad_e71534]  272.49 33.63 0 top
NOREF#91  -  [Pad_e68878]  187.09 70.83 0 top
NOREF#92  -  [Pad_e65324]  224.09 190.83 0 top
NOREF#93  -  [Pad_e72101]  82.19 96.03 0 top
NOREF#94  -  [Pad_e62132]  103.79 157.43 0 top
NOREF#95  -  [Pad_e59479]  256.09 10.83 0 top
NOREF#96  -  [Pad_e66837]  218.19 198.03 0 top
NOREF#97  -  [Pad_e65893]  273.39 73.63 0 top
NOREF#98  -  [Pad_e71162]  184.19 180.03 0 top
NOREF#99  -  [Pad_e65527]  135.32 17.98 0 top
NOREF#100  -  [Pad_e68495]  63.89 17.38 0 top
NOREF#101  -  [Pad_e73029]  221.09 27.83 0 top
NOREF#102  -  [Pad_e69066]  119.09 91.83 0 top
NOREF#103  -  [Pad_e59886]  150.99 57.03 0 top
NOREF#104  -  [Pad_e68705]  255.09 47.83 0 top
NOREF#105  -  [Pad_e69655]  218.19 179.03 0 top
NOREF#106  -  [Pad_e67404]  252.99 78.03 0 top
NOREF#107  -  [Pad_e71723]  218.19 56.03 0 top
NOREF#108  -  [Pad_e70752]  31.28 116.08 0 top
NOREF#109  -  [Pad_e61014]  252.99 17.03 0 top
NOREF#110  -  [Pad_e63442]  120.09 129.83 0 top
NOREF#111  -  [Pad_e73778]  223.09 130.83 0 top
NOREF#112  -  [Pad_e72067]  63.89 98.38 0 top
NOREF#113  -  [Pad_e67376]  223.09 70.83 0 top
NOREF#114  -  [Pad_e68889]  188.09 68.83 0 top
NOREF#115  -  [Pad_e65883]  258.09 68.83 0 top
NOREF#116  -  [Pad_e65690]  54.09 29.83 0 top
NOREF#117  -  [Pad_e64575]  238.89 95.43 0 top
NOREF#118  -  [Pad_e61013]  252.99 15.03 0 top
NOREF#119  -  [Pad_e61373]  85.09 47.83 0 top
NOREF#120  -  [Pad_e63815]  258.09 191.83 0 top
NOREF#121  -  [Pad_e67931]  29.89 139.38 0 top
NOREF#122  -  [Pad_e72670]  150.99 180.03 0 top
NOREF#123  -  [Pad_e63044]  269.28 95.08 0 top
NOREF#124  -  [Pad_e73963]  157.09 152.83 0 top
NOREF#125  -  [Pad_e72834]  54.09 192.83 0 top
NOREF#126  -  [Pad_e61935]  156.09 130.83 0 top
NOREF#127  -  [Pad_e68156]  252.99 181.03 0 top
NOREF#128  -  [Pad_e71349]  116.19 198.03 0 top
NOREF#129  -  [Pad_e62330]  48.99 179.03 0 top
NOREF#130  -  [Pad_e68335]  170.89 197.43 0 top
NOREF#131  -  [Pad_e63796]  269.28 197.08 0 top
NOREF#132  -  [Pad_e69471]  286.99 159.03 0 top
NOREF#133  -  [Pad_e71722]  204.49 53.63 0 top
NOREF#134  -  [Pad_e68720]  286.99 58.03 0 top
NOREF#135  -  [Pad_e59888]  128.89 51.23 0 top
NOREF#136  -  [Pad_e72658]  135.99 177.43 0 top
NOREF#137  -  [Pad_e74160]  88.09 169.83 0 top
NOREF#138  -  [Pad_e64018]  184.19 17.03 0 top
NOREF#139  -  [Pad_e65882]  257.09 68.83 0 top
NOREF#140  -  [Pad_e61765]  252.99 117.03 0 top
NOREF#141  -  [Pad_e60606]  119.09 153.83 0 top
NOREF#142  -  [Pad_e70224]  252.99 58.03 0 top
NOREF#143  -  [Pad_e62117]  87.09 152.83 0 top
NOREF#144  -  [Pad_e67380]  222.09 69.83 0 top
NOREF#145  -  [Pad_e73759]  233.89 139.38 0 top
NOREF#146  -  [Pad_e60224]  269.28 116.08 0 top
NOREF#147  -  [Pad_e61200]  184.99 38.03 0 top
NOREF#148  -  [Pad_e64959]  116.99 138.03 0 top
NOREF#149  -  [Pad_e61195]  184.19 36.03 0 top
NOREF#150  -  [Pad_e69839]  136.89 197.43 0 top
NOREF#151  -  [Pad_e62693]  123.09 27.83 0 top
NOREF#152  -  [Pad_e70210]  222.09 47.83 0 top
NOREF#153  -  [Pad_e65871]  256.09 70.83 0 top
NOREF#154  -  [Pad_e70213]  225.09 47.83 0 top
NOREF#155  -  [Pad_e60423]  187.09 131.83 0 top
NOREF#156  -  [Pad_e63421]  119.09 133.83 0 top
NOREF#157  -  [Pad_e67396]  239.79 74.43 0 top
NOREF#158  -  [Pad_e66078]  203.99 95.43 0 top
NOREF#159  -  [Pad_e61184]  157.09 28.83 0 top
NOREF#160  -  [Pad_e64571]  223.09 88.83 0 top
NOREF#161  -  [Pad_e59689]  205.39 33.63 0 top
NOREF#162  -  [Pad_e63639]  82.19 159.03 0 top
NOREF#163  -  [Pad_e64769]  184.19 117.03 0 top
NOREF#164  -  [Pad_e74351]  34.89 197.43 0 top
NOREF#165  -  [Pad_e70771]  20.09 110.83 0 top
NOREF#166  -  [Pad_e61201]  184.99 35.03 0 top
NOREF#167  -  [Pad_e63433]  121.09 131.83 0 top
NOREF#168  -  [Pad_e65504]  119.09 8.83 0 top
NOREF#169  -  [Pad_e64399]  33.32 57.98 0 top
NOREF#170  -  [Pad_e63272]  196.89 113.23 0 top
NOREF#171  -  [Pad_e61923]  154.09 132.83 0 top
NOREF#172  -  [Pad_e63810]  258.09 192.83 0 top
NOREF#173  -  [Pad_e60620]  123.09 151.83 0 top
NOREF#174  -  [Pad_e63245]  189.09 111.83 0 top
NOREF#175  -  [Pad_e64767]  184.19 118.03 0 top
NOREF#176  -  [Pad_e66620]  258.09 174.83 0 top
NOREF#177  -  [Pad_e66081]  205.39 94.63 0 top
NOREF#178  -  [Pad_e62511]  218.19 16.03 0 top
NOREF#179  -  [Pad_e60791]  53.09 173.83 0 top
NOREF#180  -  [Pad_e68160]  230.89 174.23 0 top
NOREF#181  -  [Pad_e73590]  19.09 89.83 0 top
NOREF#182  -  [Pad_e66826]  188.09 190.83 0 top
NOREF#183  -  [Pad_e60043]  52.09 70.83 0 top
NOREF#184  -  [Pad_e62678]  123.09 30.83 0 top
NOREF#185  -  [Pad_e69642]  189.09 171.83 0 top
NOREF#186  -  [Pad_e67024]  116.19 18.03 0 top
NOREF#187  -  [Pad_e65117]  21.09 154.83 0 top
NOREF#188  -  [Pad_e68126]  221.09 173.83 0 top
NOREF#189  -  [Pad_e65874]  259.09 70.83 0 top
NOREF#190  -  [Pad_e68880]  189.09 70.83 0 top
NOREF#191  -  [Pad_e70028]  35.79 14.43 0 top
NOREF#192  -  [Pad_e70199]  221.09 49.83 0 top
NOREF#193  -  [Pad_e64004]  157.09 8.83 0 top
NOREF#194  -  [Pad_e69271]  53.09 109.83 0 top
NOREF#195  -  [Pad_e71692]  201.28 54.08 0 top
NOREF#196  -  [Pad_e70376]  167.28 74.08 0 top
NOREF#197  -  [Pad_e72443]  199.89 160.38 0 top
NOREF#198  -  [Pad_e74363]  33.32 200.98 0 top
NOREF#199  -  [Pad_e61738]  225.09 112.83 0 top
NOREF#200  -  [Pad_e63798]  256.09 194.83 0 top
NOREF#201  -  [Pad_e60610]  123.09 153.83 0 top
NOREF#202  -  [Pad_e70412]  184.99 78.03 0 top
NOREF#203  -  [Pad_e69848]  150.99 201.03 0 top
NOREF#204  -  [Pad_e67963]  48.19 138.03 0 top
NOREF#205  -  [Pad_e60809]  51.09 169.83 0 top
NOREF#206  -  [Pad_e73035]  238.89 34.43 0 top
NOREF#207  -  [Pad_e63441]  119.09 129.83 0 top
NOREF#208  -  [Pad_e73392]  87.09 70.83 0 top
NOREF#209  -  [Pad_e63071]  272.89 95.43 0 top
NOREF#210  -  [Pad_e65517]  137.39 13.63 0 top
NOREF#211  -  [Pad_e63833]  286.99 198.03 0 top
NOREF#212  -  [Pad_e71886]  119.09 70.83 0 top
NOREF#213  -  [Pad_e61004]  239.79 14.43 0 top
NOREF#214  -  [Pad_e60228]  258.09 113.83 0 top
NOREF#215  -  [Pad_e64177]  89.09 31.83 0 top
NOREF#216  -  [Pad_e68317]  156.09 193.83 0 top
NOREF#217  -  [Pad_e71525]  255.09 27.83 0 top
NOREF#218  -  [Pad_e62126]  86.09 150.83 0 top
NOREF#219  -  [Pad_e73232]  184.99 58.03 0 top
NOREF#220  -  [Pad_e63074]  272.49 94.63 0 top
NOREF#221  -  [Pad_e64183]  85.09 29.83 0 top
NOREF#222  -  [Pad_e59481]  258.09 10.83 0 top
NOREF#223  -  [Pad_e70392]  153.09 68.83 0 top
NOREF#224  -  [Pad_e64394]  48.19 57.03 0 top
NOREF#225  -  [Pad_e66275]  150.99 118.03 0 top
NOREF#226  -  [Pad_e63231]  199.89 119.38 0 top
NOREF#227  -  [Pad_e60617]  120.09 151.83 0 top
NOREF#228  -  [Pad_e66249]  122.09 112.83 0 top
NOREF#229  -  [Pad_e61007]  252.19 16.03 0 top
NOREF#230  -  [Pad_e72457]  189.09 152.83 0 top
NOREF#231  -  [Pad_e67595]  169.32 98.98 0 top
NOREF#232  -  [Pad_e64390]  34.49 53.63 0 top
NOREF#233  -  [Pad_e63992]  155.09 10.83 0 top
NOREF#234  -  [Pad_e67219]  33.32 37.98 0 top
NOREF#235  -  [Pad_e67018]  101.99 14.43 0 top
NOREF#236  -  [Pad_e60608]  121.09 153.83 0 top
NOREF#237  -  [Pad_e69096]  150.99 99.03 0 top
NOREF#238  -  [Pad_e72106]  82.99 98.03 0 top
NOREF#239  -  [Pad_e63267]  218.99 118.03 0 top
NOREF#240  -  [Pad_e61760]  252.19 120.03 0 top
NOREF#241  -  [Pad_e72481]  218.99 158.03 0 top
NOREF#242  -  [Pad_e60257]  286.19 117.03 0 top
NOREF#243  -  [Pad_e61383]  116.19 56.03 0 top
NOREF#244  -  [Pad_e67759]  89.09 111.83 0 top
NOREF#245  -  [Pad_e60602]  120.09 154.83 0 top
NOREF#246  -  [Pad_e69251]  53.09 113.83 0 top
NOREF#247  -  [Pad_e71898]  121.09 68.83 0 top
NOREF#248  -  [Pad_e71713]  187.09 47.83 0 top
NOREF#249  -  [Pad_e62315]  19.09 169.83 0 top
NOREF#250  -  [Pad_e61570]  34.49 73.63 0 top
NOREF#251  -  [Pad_e71702]  191.09 50.83 0 top
NOREF#252  -  [Pad_e61358]  85.09 50.83 0 top
NOREF#253  -  [Pad_e73200]  156.09 51.83 0 top
NOREF#254  -  [Pad_e63804]  257.09 193.83 0 top
NOREF#255  -  [Pad_e60997]  221.09 7.83 0 top
NOREF#256  -  [Pad_e70215]  238.89 54.43 0 top
NOREF#257  -  [Pad_e65303]  223.09 194.83 0 top
NOREF#258  -  [Pad_e66435]  52.09 132.83 0 top
NOREF#259  -  [Pad_e73595]  19.09 88.83 0 top
NOREF#260  -  [Pad_e72646]  122.09 172.83 0 top
NOREF#261  -  [Pad_e67567]  153.09 90.83 0 top
NOREF#262  -  [Pad_e72448]  190.09 154.83 0 top
NOREF#263  -  [Pad_e67193]  19.09 29.83 0 top
NOREF#264  -  [Pad_e71708]  187.09 48.83 0 top
NOREF#265  -  [Pad_e60073]  82.99 75.03 0 top
NOREF#266  -  [Pad_e64937]  87.09 131.83 0 top
NOREF#267  -  [Pad_e60619]  122.09 151.83 0 top
NOREF#268  -  [Pad_e68309]  153.09 194.83 0 top
NOREF#269  -  [Pad_e69270]  52.09 109.83 0 top
NOREF#270  -  [Pad_e63986]  154.09 11.83 0 top
NOREF#271  -  [Pad_e59681]  187.09 27.83 0 top
NOREF#272  -  [Pad_e60992]  221.09 8.83 0 top
NOREF#273  -  [Pad_e59683]  189.09 27.83 0 top
NOREF#274  -  [Pad_e66427]  63.89 139.38 0 top
NOREF#275  -  [Pad_e59491]  258.09 8.83 0 top
NOREF#276  -  [Pad_e68702]  257.09 48.83 0 top
NOREF#277  -  [Pad_e63045]  255.09 92.83 0 top
NOREF#278  -  [Pad_e66995]  87.09 11.83 0 top
NOREF#279  -  [Pad_e71150]  154.09 170.83 0 top
NOREF#280  -  [Pad_e70963]  223.09 150.83 0 top
NOREF#281  -  [Pad_e71733]  198.2 54.74 0 top
NOREF#282  -  [Pad_e65676]  65.28 34.08 0 top
NOREF#283  -  [Pad_e65336]  252.99 201.03 0 top
NOREF#284  -  [Pad_e69814]  120.09 194.83 0 top
NOREF#285  -  [Pad_e69259]  51.09 111.83 0 top
NOREF#286  -  [Pad_e72467]  189.09 150.83 0 top
NOREF#287  -  [Pad_e73962]  156.09 152.83 0 top
NOREF#288  -  [Pad_e72274]  257.09 130.83 0 top
NOREF#289  -  [Pad_e70569]  89.09 92.83 0 top
NOREF#290  -  [Pad_e65122]  21.09 153.83 0 top
NOREF#291  -  [Pad_e72826]  51.09 193.83 0 top
NOREF#292  -  [Pad_e68325]  154.09 191.83 0 top
NOREF#293  -  [Pad_e61755]  238.89 116.43 0 top
NOREF#294  -  [Pad_e70027]  34.89 14.43 0 top
NOREF#295  -  [Pad_e65866]  256.09 71.83 0 top
NOREF#296  -  [Pad_e66452]  54.09 129.83 0 top
NOREF#297  -  [Pad_e70041]  28.2 14.74 0 top
NOREF#298  -  [Pad_e65134]  18.09 150.83 0 top
NOREF#299  -  [Pad_e66070]  189.09 89.83 0 top
NOREF#300  -  [Pad_e70384]  155.09 70.83 0 top
NOREF#301  -  [Pad_e71523]  258.09 28.83 0 top
NOREF#302  -  [Pad_e73960]  154.09 152.83 0 top
NOREF#303  -  [Pad_e72859]  67.32 200.98 0 top
NOREF#304  -  [Pad_e63820]  258.09 190.83 0 top
NOREF#305  -  [Pad_e71336]  89.09 191.83 0 top
NOREF#306  -  [Pad_e68711]  272.89 54.43 0 top
NOREF#307  -  [Pad_e62332]  26.89 173.23 0 top
NOREF#308  -  [Pad_e67208]  35.79 34.43 0 top
NOREF#309  -  [Pad_e59502]  272.49 13.63 0 top
NOREF#310  -  [Pad_e72634]  120.09 174.83 0 top
NOREF#311  -  [Pad_e60438]  203.99 136.43 0 top
NOREF#312  -  [Pad_e67575]  156.09 89.83 0 top
NOREF#313  -  [Pad_e62482]  188.09 11.83 0 top
NOREF#314  -  [Pad_e68318]  157.09 193.83 0 top
NOREF#315  -  [Pad_e71356]  94.89 194.23 0 top
NOREF#316  -  [Pad_e60075]  67.32 77.98 0 top
NOREF#317  -  [Pad_e60223]  267.89 119.38 0 top
NOREF#318  -  [Pad_e73782]  222.09 129.83 0 top
NOREF#319  -  [Pad_e64551]  223.09 92.83 0 top
NOREF#320  -  [Pad_e61372]  89.09 48.83 0 top
NOREF#321  -  [Pad_e74143]  86.09 172.83 0 top
NOREF#322  -  [Pad_e74323]  29.89 200.38 0 top
NOREF#323  -  [Pad_e66254]  122.09 111.83 0 top
NOREF#324  -  [Pad_e73031]  223.09 27.83 0 top
NOREF#325  -  [Pad_e71339]  87.09 190.83 0 top
NOREF#326  -  [Pad_e70586]  86.09 88.83 0 top
NOREF#327  -  [Pad_e63823]  272.89 197.43 0 top
NOREF#328  -  [Pad_e67558]  154.09 92.83 0 top
NOREF#329  -  [Pad_e68330]  154.09 190.83 0 top
NOREF#330  -  [Pad_e69850]  150.99 200.03 0 top
NOREF#331  -  [Pad_e68344]  184.99 201.03 0 top
NOREF#332  -  [Pad_e66642]  271.99 177.43 0 top
NOREF#333  -  [Pad_e62139]  116.99 159.03 0 top
NOREF#334  -  [Pad_e64175]  87.09 31.83 0 top
NOREF#335  -  [Pad_e70034]  48.19 17.03 0 top
NOREF#336  -  [Pad_e68700]  255.09 48.83 0 top
NOREF#337  -  [Pad_e60820]  82.19 180.03 0 top
NOREF#338  -  [Pad_e68127]  222.09 173.83 0 top
NOREF#339  -  [Pad_e70585]  85.09 88.83 0 top
NOREF#340  -  [Pad_e60815]  68.89 176.43 0 top
NOREF#341  -  [Pad_e66266]  135.99 116.43 0 top
NOREF#342  -  [Pad_e68896]  190.09 67.83 0 top
NOREF#343  -  [Pad_e68121]  221.09 174.83 0 top
NOREF#344  -  [Pad_e71717]  191.09 47.83 0 top
NOREF#345  -  [Pad_e69640]  187.09 171.83 0 top
NOREF#346  -  [Pad_e67773]  103.39 115.63 0 top
NOREF#347  -  [Pad_e70777]  21.09 109.83 0 top
NOREF#348  -  [Pad_e72647]  123.09 172.83 0 top
NOREF#349  -  [Pad_e64361]  17.09 51.83 0 top
NOREF#350  -  [Pad_e69638]  190.09 172.83 0 top
NOREF#351  -  [Pad_e71341]  89.09 190.83 0 top
NOREF#352  -  [Pad_e66445]  52.09 130.83 0 top
NOREF#353  -  [Pad_e68328]  157.09 191.83 0 top
NOREF#354  -  [Pad_e71882]  120.09 71.83 0 top
NOREF#355  -  [Pad_e71888]  121.09 70.83 0 top
NOREF#356  -  [Pad_e73771]  221.09 131.83 0 top
NOREF#357  -  [Pad_e62702]  150.19 37.03 0 top
NOREF#358  -  [Pad_e66450]  52.09 129.83 0 top
NOREF#359  -  [Pad_e62517]  218.99 15.03 0 top
NOREF#360  -  [Pad_e61957]  164.2 136.74 0 top
NOREF#361  -  [Pad_e64761]  157.09 109.83 0 top
NOREF#362  -  [Pad_e59659]  199.89 37.38 0 top
NOREF#363  -  [Pad_e60238]  258.09 111.83 0 top
NOREF#364  -  [Pad_e62708]  128.89 31.23 0 top
NOREF#365  -  [Pad_e59668]  189.09 30.83 0 top
NOREF#366  -  [Pad_e62686]  121.09 28.83 0 top
NOREF#367  -  [Pad_e60059]  53.09 67.83 0 top
NOREF#368  -  [Pad_e73224]  171.79 54.43 0 top
NOREF#369  -  [Pad_e61555]  21.09 69.83 0 top
NOREF#370  -  [Pad_e70778]  33.99 116.43 0 top
NOREF#371  -  [Pad_e68884]  188.09 69.83 0 top
NOREF#372  -  [Pad_e62145]  96.2 157.74 0 top
NOREF#373  -  [Pad_e69838]  135.99 197.43 0 top
NOREF#374  -  [Pad_e73773]  223.09 131.83 0 top
NOREF#375  -  [Pad_e71503]  267.89 37.38 0 top
NOREF#376  -  [Pad_e64952]  103.79 136.43 0 top
NOREF#377  -  [Pad_e62115]  85.09 152.83 0 top
NOREF#378  -  [Pad_e65341]  232.2 197.74 0 top
NOREF#379  -  [Pad_e67016]  88.09 7.83 0 top
NOREF#380  -  [Pad_e68899]  204.89 74.43 0 top
NOREF#381  -  [Pad_e69641]  188.09 171.83 0 top
NOREF#382  -  [Pad_e73979]  184.19 159.03 0 top
NOREF#383  -  [Pad_e65689]  53.09 29.83 0 top
NOREF#384  -  [Pad_e65146]  48.19 160.03 0 top
NOREF#385  -  [Pad_e64933]  88.09 132.83 0 top
NOREF#386  -  [Pad_e67033]  96.2 14.74 0 top
NOREF#387  -  [Pad_e63455]  150.99 138.03 0 top
NOREF#388  -  [Pad_e67775]  116.19 118.03 0 top
NOREF#389  -  [Pad_e62501]  187.09 7.83 0 top
NOREF#390  -  [Pad_e74346]  18.09 190.83 0 top
NOREF#391  -  [Pad_e72850]  68.49 196.63 0 top
NOREF#392  -  [Pad_e72107]  67.32 98.98 0 top
NOREF#393  -  [Pad_e64203]  116.19 36.03 0 top
NOREF#394  -  [Pad_e68119]  233.89 180.38 0 top
NOREF#395  -  [Pad_e66267]  136.89 116.43 0 top
NOREF#396  -  [Pad_e73040]  252.19 38.03 0 top
NOREF#397  -  [Pad_e71694]  188.09 51.83 0 top
NOREF#398  -  [Pad_e66829]  191.09 190.83 0 top
NOREF#399  -  [Pad_e73596]  20.09 88.83 0 top
NOREF#400  -  [Pad_e66256]  119.09 110.83 0 top
NOREF#401  -  [Pad_e67220]  26.89 31.23 0 top
NOREF#402  -  [Pad_e71905]  123.09 67.83 0 top
NOREF#403  -  [Pad_e64392]  48.19 58.03 0 top
NOREF#404  -  [Pad_e66625]  258.09 173.83 0 top
NOREF#405  -  [Pad_e69267]  54.09 110.83 0 top
NOREF#406  -  [Pad_e64763]  170.89 116.43 0 top
NOREF#407  -  [Pad_e69458]  256.09 150.83 0 top
NOREF#408  -  [Pad_e73788]  239.79 136.43 0 top
NOREF#409  -  [Pad_e71531]  272.89 34.43 0 top
NOREF#410  -  [Pad_e63239]  188.09 112.83 0 top
NOREF#411  -  [Pad_e74155]  88.09 170.83 0 top
NOREF#412  -  [Pad_e70956]  221.09 151.83 0 top
NOREF#413  -  [Pad_e64745]  156.09 112.83 0 top
NOREF#414  -  [Pad_e72637]  123.09 174.83 0 top
NOREF#415  -  [Pad_e63448]  137.79 136.43 0 top
NOREF#416  -  [Pad_e73948]  167.28 157.08 0 top
NOREF#417  -  [Pad_e67778]  116.19 119.03 0 top
NOREF#418  -  [Pad_e60811]  53.09 169.83 0 top
NOREF#419  -  [Pad_e61011]  252.99 16.03 0 top
NOREF#420  -  [Pad_e67941]  20.09 132.83 0 top
NOREF#421  -  [Pad_e67747]  87.09 113.83 0 top
NOREF#422  -  [Pad_e61177]  155.09 29.83 0 top
NOREF#423  -  [Pad_e65677]  51.09 31.83 0 top
NOREF#424  -  [Pad_e60424]  188.09 131.83 0 top
NOREF#425  -  [Pad_e62303]  17.09 171.83 0 top
NOREF#426  -  [Pad_e74352]  35.79 197.43 0 top
NOREF#427  -  [Pad_e62493]  189.09 9.83 0 top
NOREF#428  -  [Pad_e60435]  189.09 129.83 0 top
NOREF#429  -  [Pad_e70754]  18.09 113.83 0 top
NOREF#430  -  [Pad_e72089]  51.09 88.83 0 top
NOREF#431  -  [Pad_e63066]  256.09 88.83 0 top
NOREF#432  -  [Pad_e71884]  122.09 71.83 0 top
NOREF#433  -  [Pad_e64548]  235.28 95.08 0 top
NOREF#434  -  [Pad_e65310]  225.09 193.83 0 top
NOREF#435  -  [Pad_e63065]  255.09 88.83 0 top
NOREF#436  -  [Pad_e63620]  52.09 152.83 0 top
NOREF#437  -  [Pad_e63432]  120.09 131.83 0 top
NOREF#438  -  [Pad_e65338]  252.99 200.03 0 top
NOREF#439  -  [Pad_e69627]  189.09 174.83 0 top
NOREF#440  -  [Pad_e64940]  85.09 130.83 0 top
NOREF#441  -  [Pad_e74136]  99.28 176.08 0 top
NOREF#442  -  [Pad_e63621]  53.09 152.83 0 top
NOREF#443  -  [Pad_e70959]  224.09 151.83 0 top
NOREF#444  -  [Pad_e69447]  255.09 152.83 0 top
NOREF#445  -  [Pad_e73237]  164.2 54.74 0 top
NOREF#446  -  [Pad_e67032]  94.89 11.23 0 top
NOREF#447  -  [Pad_e72453]  190.09 153.83 0 top
NOREF#448  -  [Pad_e69473]  286.99 158.03 0 top
NOREF#449  -  [Pad_e61178]  156.09 29.83 0 top
NOREF#450  -  [Pad_e64181]  88.09 30.83 0 top
NOREF#451  -  [Pad_e71697]  191.09 51.83 0 top
NOREF#452  -  [Pad_e62141]  116.99 158.03 0 top
NOREF#453  -  [Pad_e65717]  62.2 34.74 0 top
NOREF#454  -  [Pad_e73959]  153.09 152.83 0 top
NOREF#455  -  [Pad_e64362]  18.09 51.83 0 top
NOREF#456  -  [Pad_e67579]  155.09 88.83 0 top
NOREF#457  -  [Pad_e61359]  86.09 50.83 0 top
NOREF#458  -  [Pad_e62890]  82.19 57.03 0 top
NOREF#459  -  [Pad_e72831]  51.09 192.83 0 top
NOREF#460  -  [Pad_e59855]  120.09 50.83 0 top
NOREF#461  -  [Pad_e67402]  252.19 77.03 0 top
NOREF#462  -  [Pad_e62111]  86.09 153.83 0 top
NOREF#463  -  [Pad_e70968]  239.79 157.43 0 top
NOREF#464  -  [Pad_e69249]  51.09 113.83 0 top
NOREF#465  -  [Pad_e71521]  256.09 28.83 0 top
NOREF#466  -  [Pad_e59490]  257.09 8.83 0 top
NOREF#467  -  [Pad_e64210]  116.99 37.03 0 top
NOREF#468  -  [Pad_e70403]  170.89 74.43 0 top
NOREF#469  -  [Pad_e64549]  221.09 92.83 0 top
NOREF#470  -  [Pad_e70211]  223.09 47.83 0 top
NOREF#471  -  [Pad_e71910]  136.49 73.63 0 top
NOREF#472  -  [Pad_e68693]  258.09 50.83 0 top
NOREF#473  -  [Pad_e74164]  103.79 176.43 0 top
NOREF#474  -  [Pad_e72276]  259.09 130.83 0 top
NOREF#475  -  [Pad_e69650]  203.99 177.43 0 top
NOREF#476  -  [Pad_e61551]  17.09 69.83 0 top
NOREF#477  -  [Pad_e67215]  48.99 36.03 0 top
NOREF#478  -  [Pad_e66803]  199.89 200.38 0 top
NOREF#479  -  [Pad_e66997]  89.09 11.83 0 top
